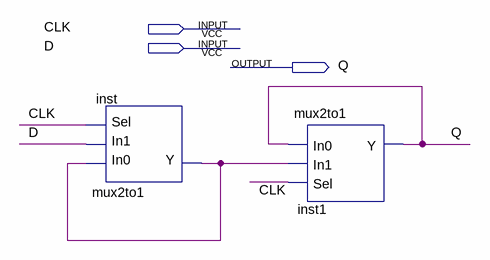
[diagram p0: schematic sheet]
// Quartus schematic d-ff_mux.bdf as structural Verilog: 2 symbols, 3 pins
module \d-ff_mux  (
  input  CLK,
  input  D,
  output Q
);

  wire inst_y;

  mux2to1 inst (.In0(inst_y), .In1(D), .Sel(CLK), .Y(inst_y));
  mux2to1 inst1 (.In0(Q), .In1(inst_y), .Sel(CLK), .Y(Q));
endmodule
